# Altium schematic sheet CPU_Power.SchDoc: Title
size A1; Date: Date; CompanyName: Integrated Micro-Electronics Bulgaria; Organization: Design & Development Department; Address1: Drawing Type; Address2: Address 1; Address3: Address 2; Address4: Address 3; DocumentNumber: 730xxx; Revision: 01; SheetNumber: 1; SheetTotal: 1; PageSetup: Record=PageOptions|CenterHorizontal=True|CenterVertical=True|PrintScale=0.70|XCorrection=1.00|YCorrection=1.00|PrintKind=2|BorderSize=5000000|LeftOffset=0|BottomOffset=0|Orientation=2|PaperLength=1000|PaperWidth=1000|Scale=100|PaperSource=7|PrintQuality=-4|MediaType=1|DitherType=10|PaperKind=A4|PrintScaleMode=1; SheetSize: A3; Time: Time; ModifiedDate: Mod. Date
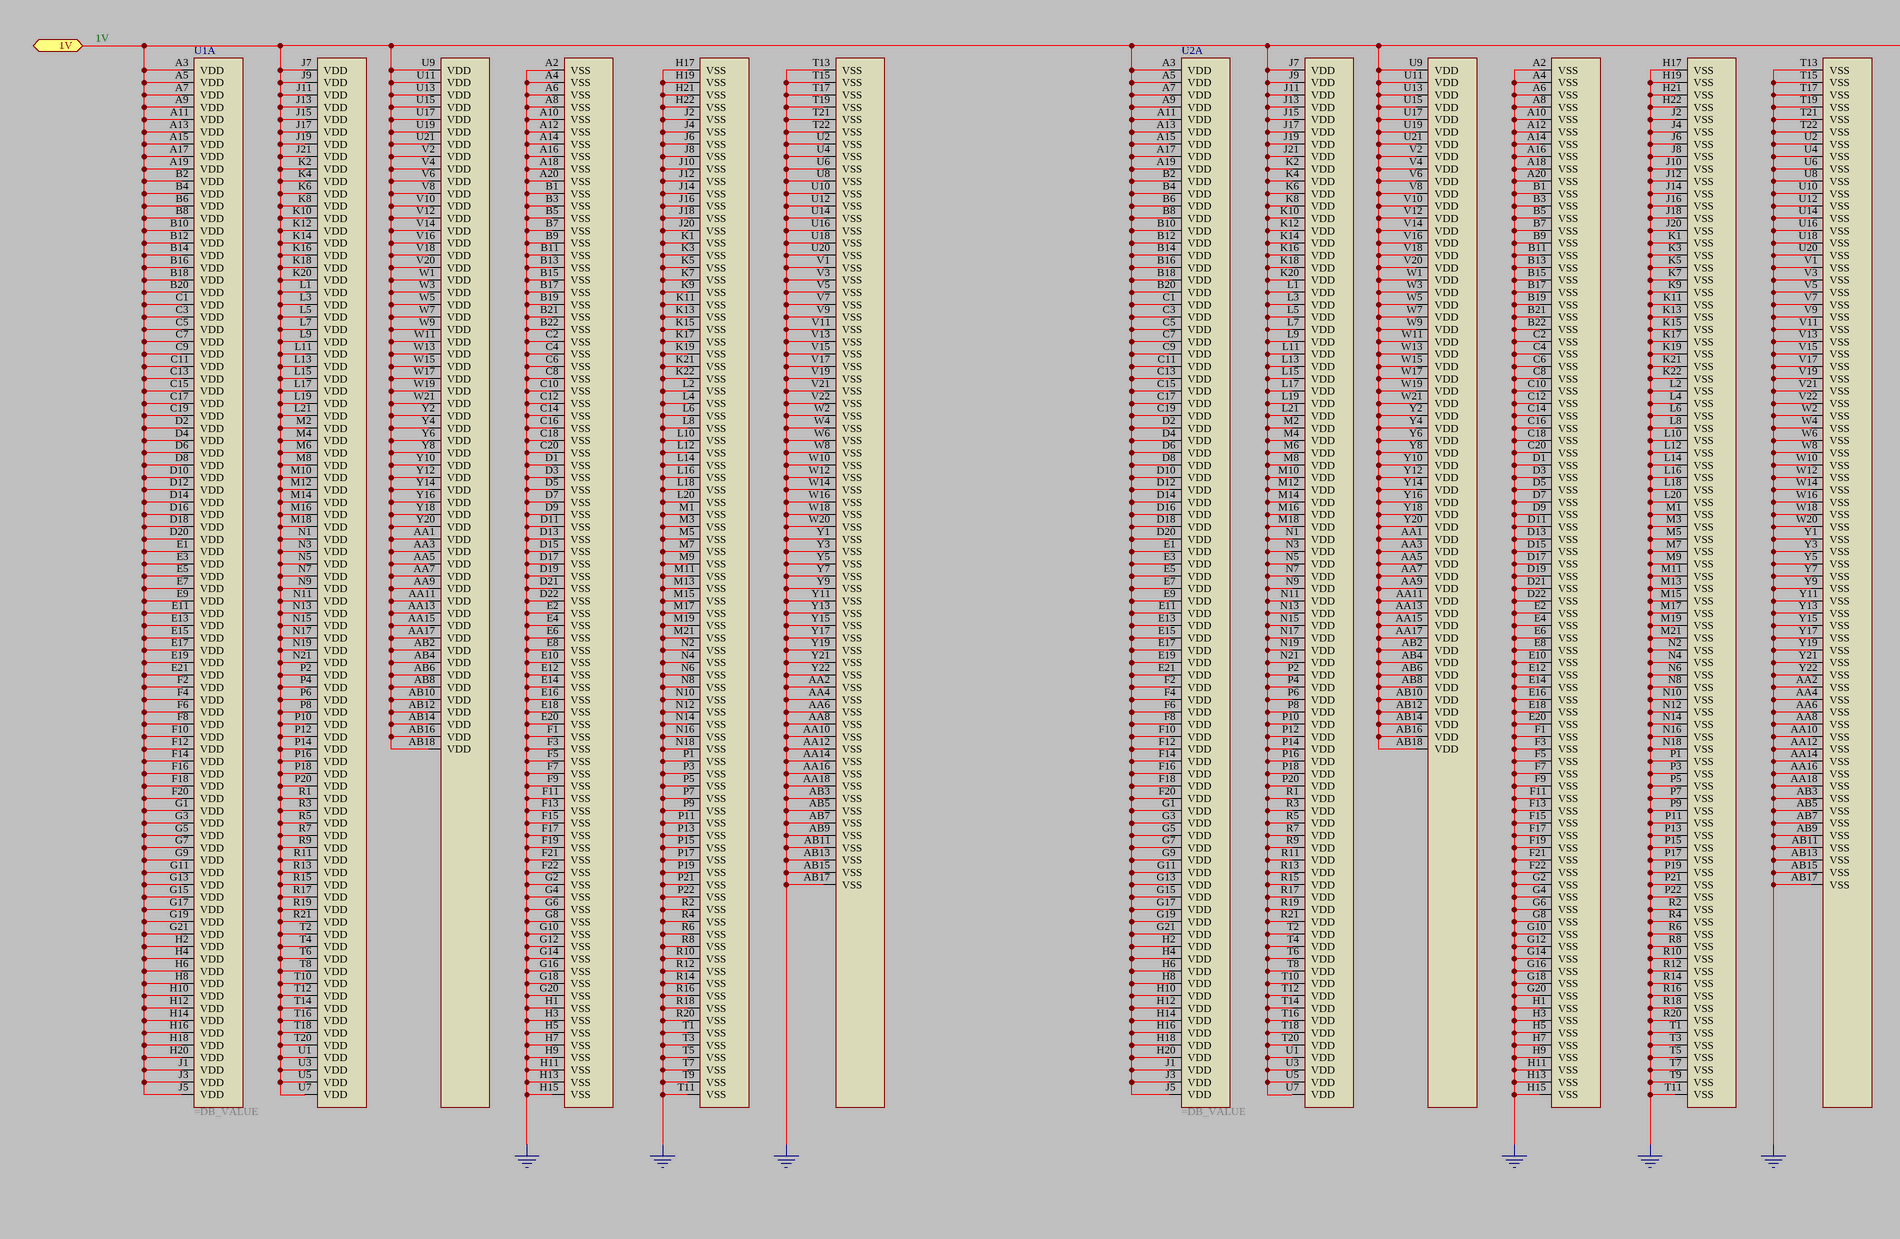
[diagram p0: CPU_Power.SchDoc, top left]
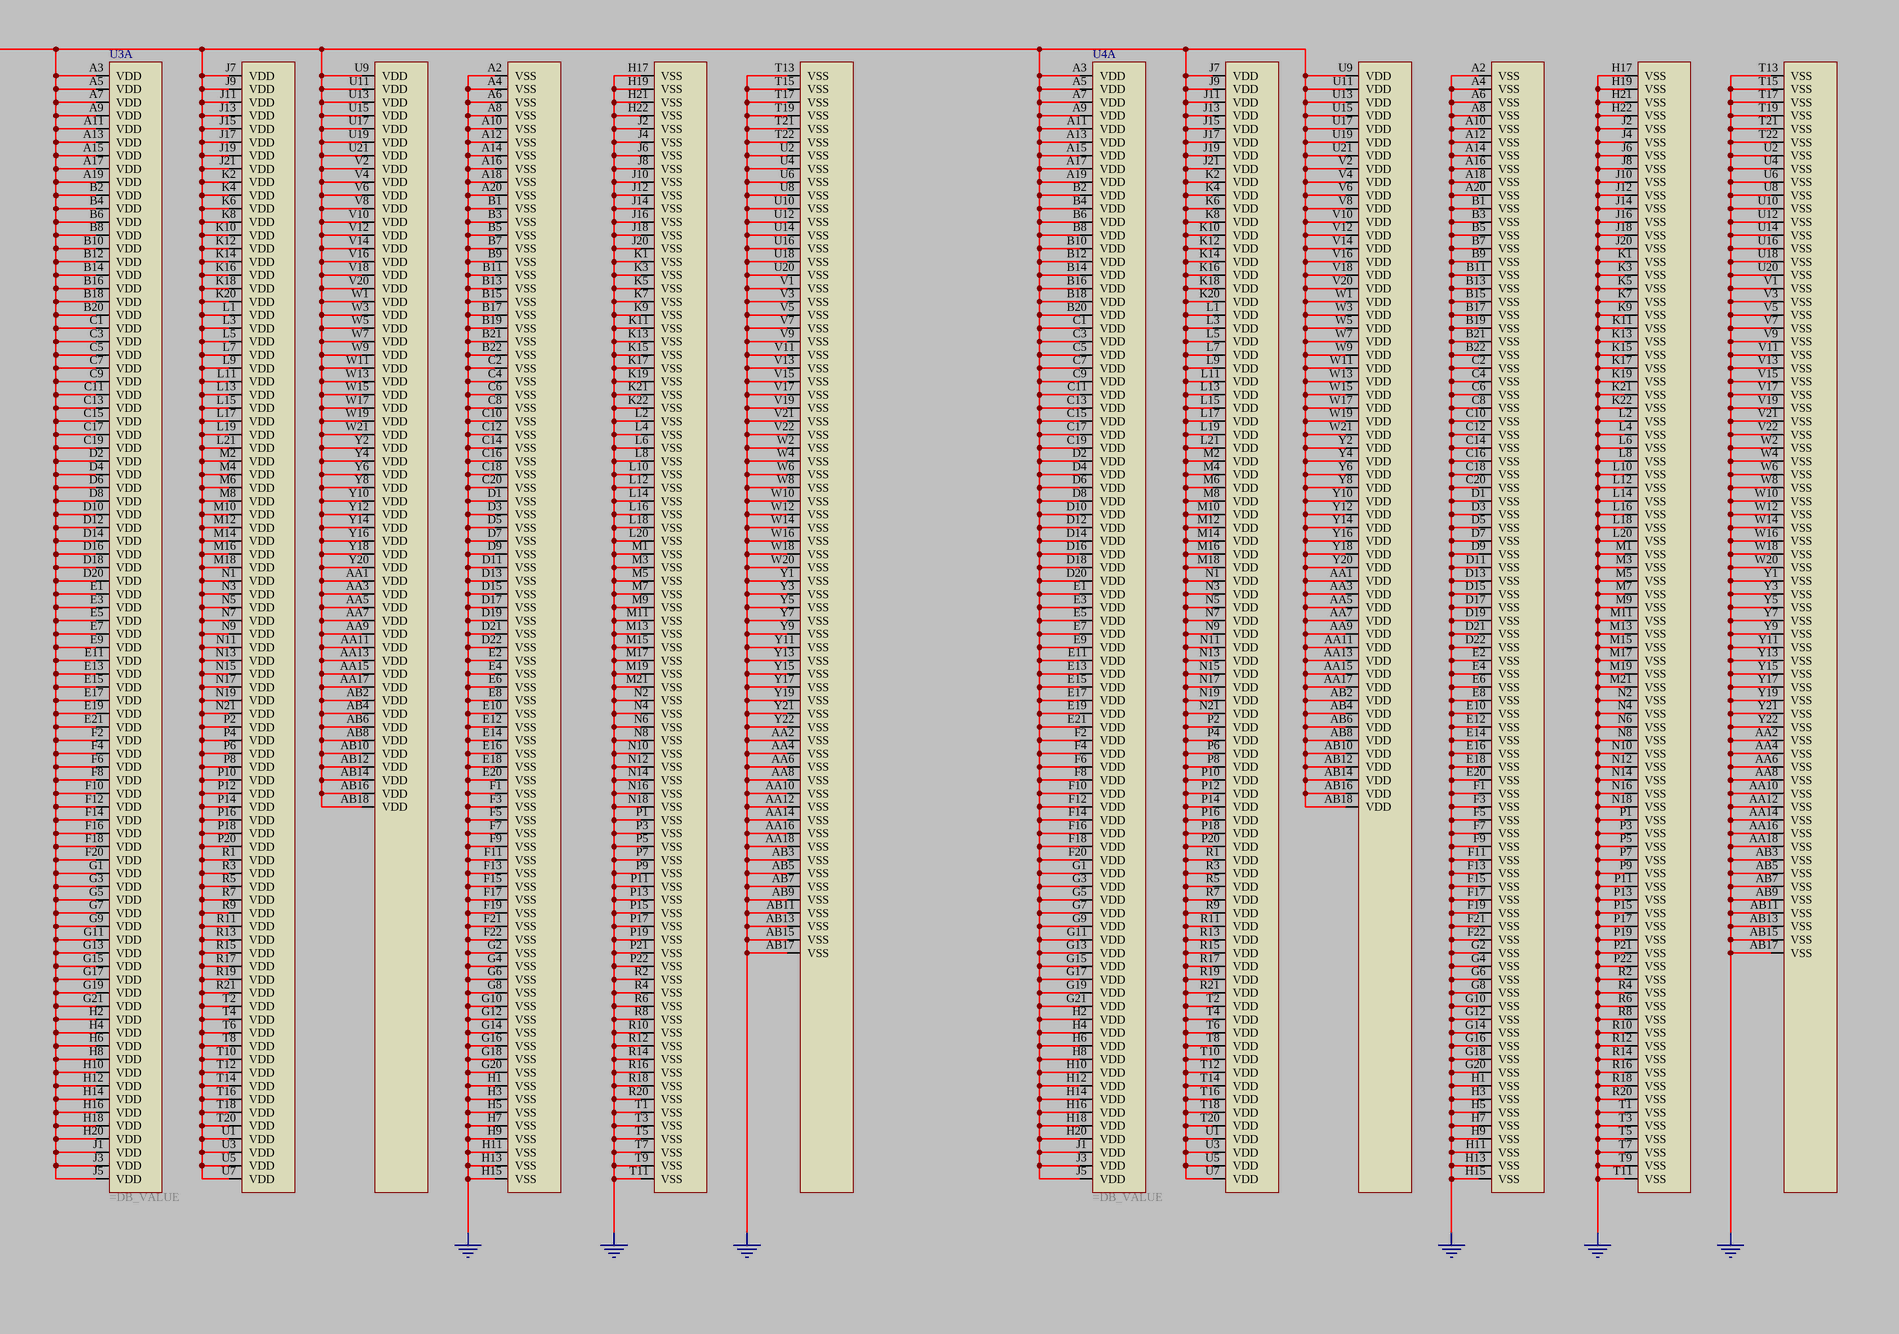
[diagram p1: CPU_Power.SchDoc, top right]
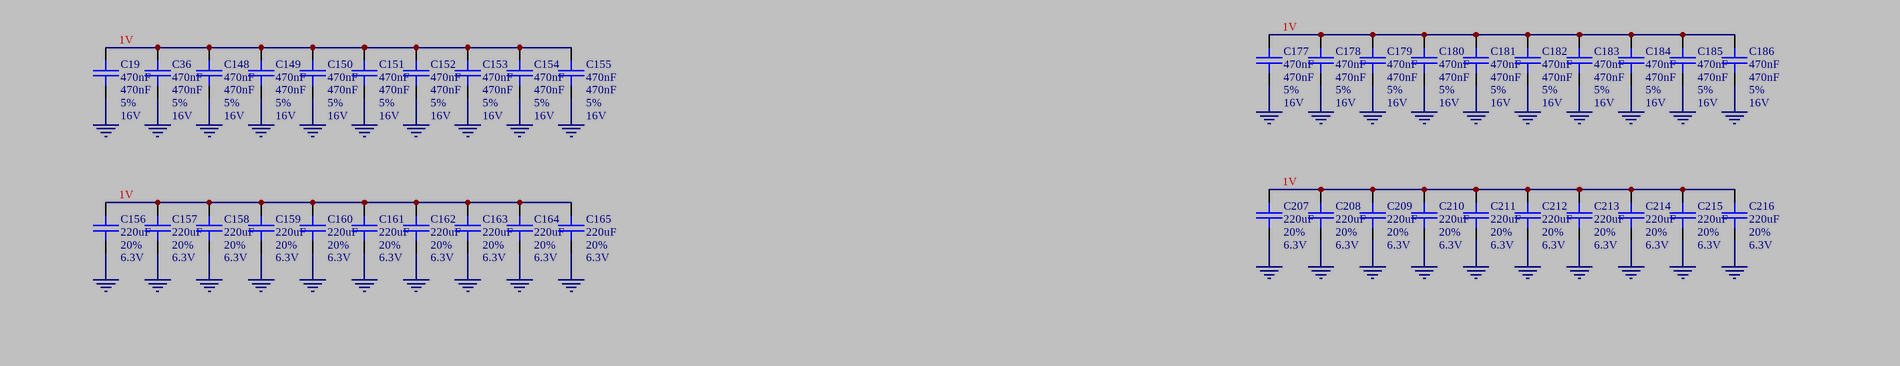
[diagram p2: CPU_Power.SchDoc, bottom left]
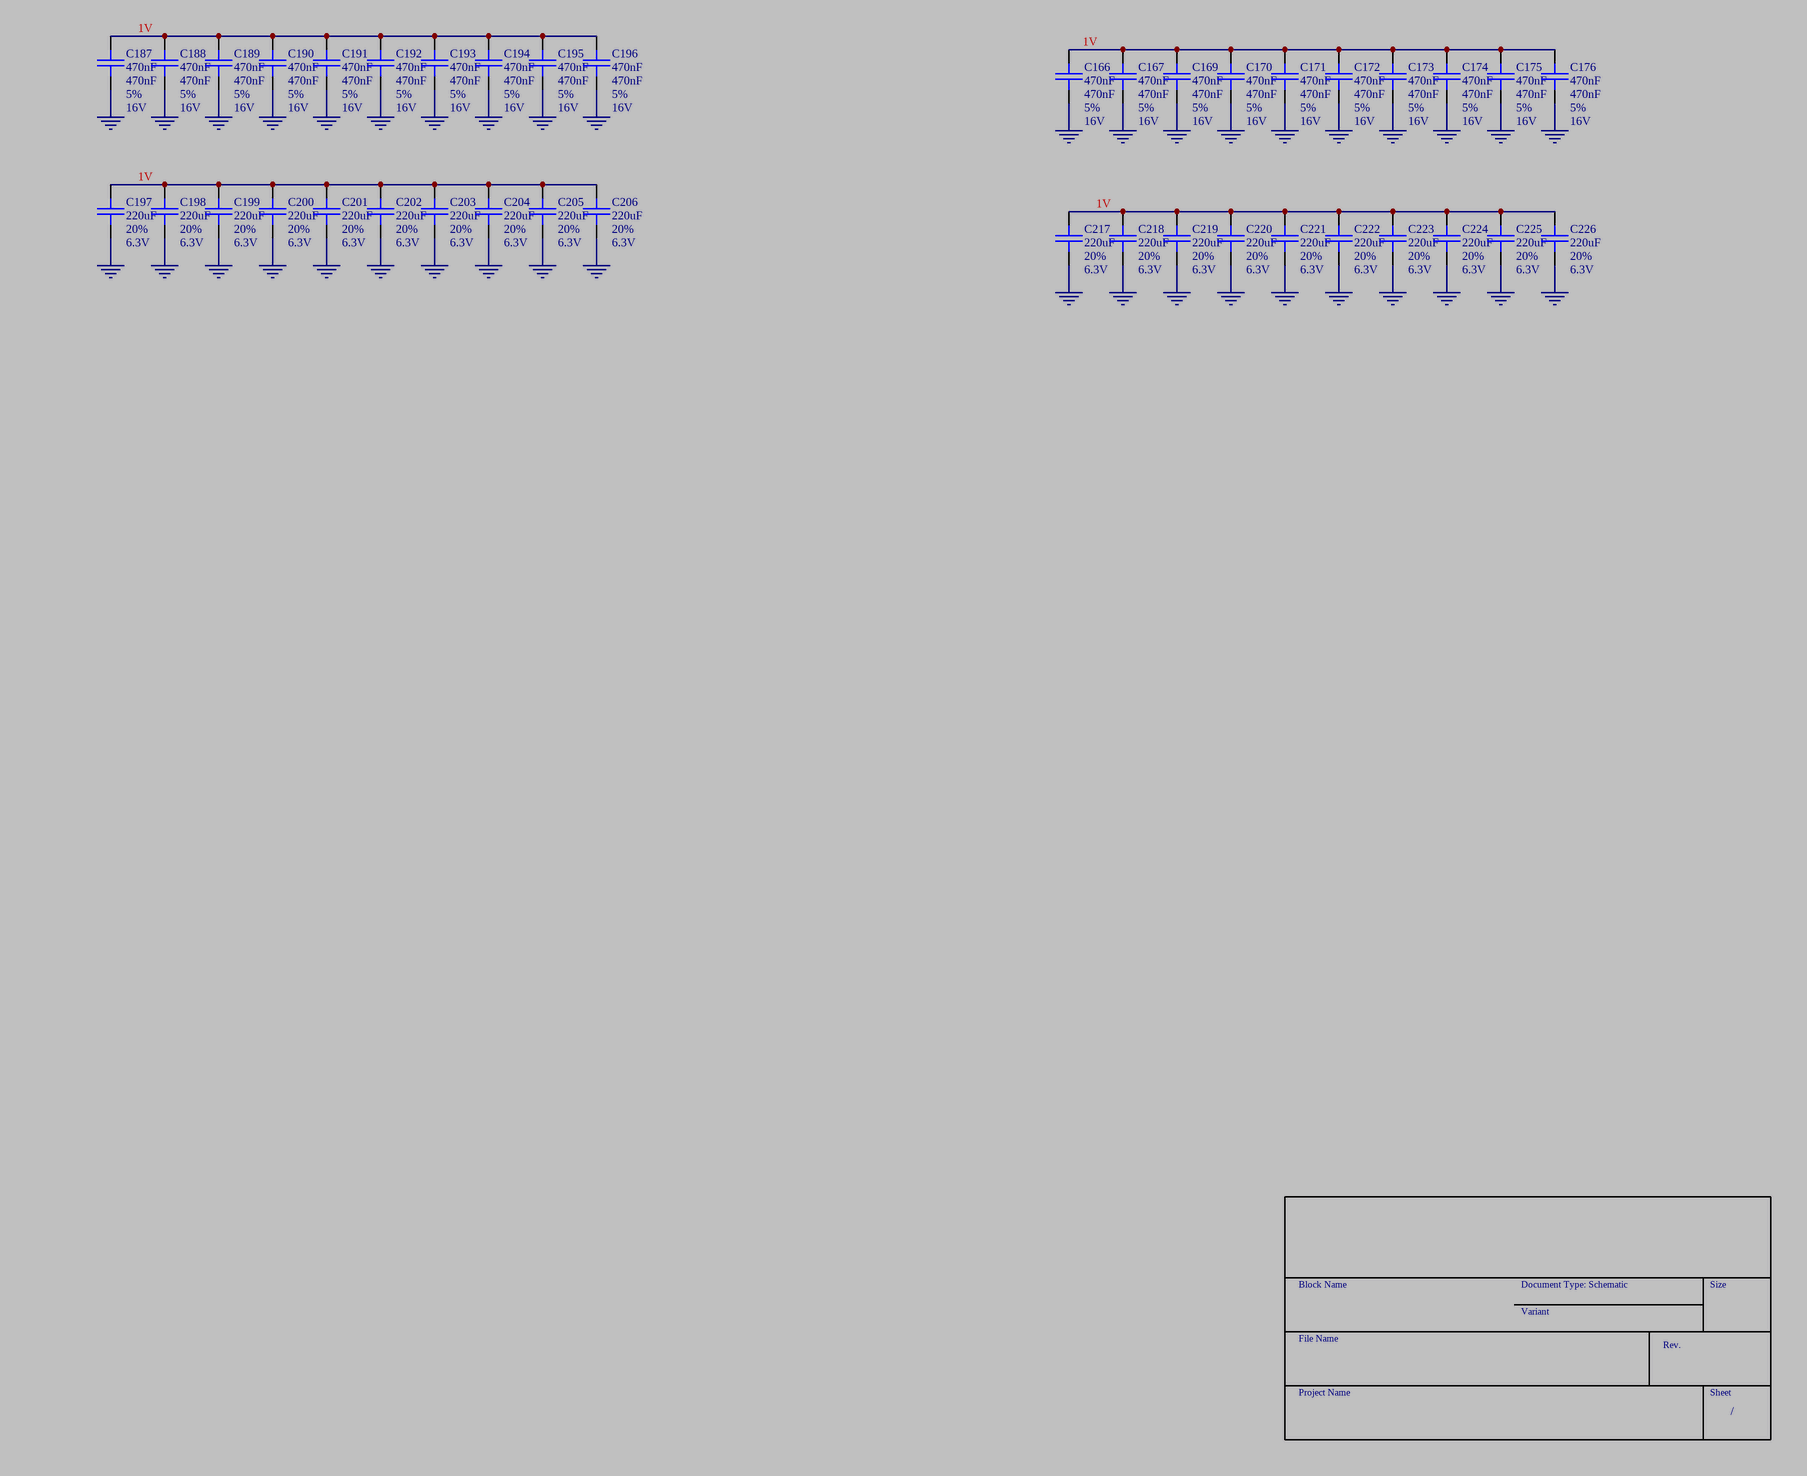
[diagram p3: CPU_Power.SchDoc, bottom right]

## Parts
C19  470nF  DB_TOLERANCE: 5%  DB_VOLTAGE: 16V  [SMD_0603_CAPC1608X95N]
C36  470nF  DB_TOLERANCE: 5%  DB_VOLTAGE: 16V  [SMD_0603_CAPC1608X95N]
C148  470nF  DB_TOLERANCE: 5%  DB_VOLTAGE: 16V  [SMD_0603_CAPC1608X95N]
C149  470nF  DB_TOLERANCE: 5%  DB_VOLTAGE: 16V  [SMD_0603_CAPC1608X95N]
C150  470nF  DB_TOLERANCE: 5%  DB_VOLTAGE: 16V  [SMD_0603_CAPC1608X95N]
C151  470nF  DB_TOLERANCE: 5%  DB_VOLTAGE: 16V  [SMD_0603_CAPC1608X95N]
C152  470nF  DB_TOLERANCE: 5%  DB_VOLTAGE: 16V  [SMD_0603_CAPC1608X95N]
C153  470nF  DB_TOLERANCE: 5%  DB_VOLTAGE: 16V  [SMD_0603_CAPC1608X95N]
C154  470nF  DB_TOLERANCE: 5%  DB_VOLTAGE: 16V  [SMD_0603_CAPC1608X95N]
C155  470nF  DB_TOLERANCE: 5%  DB_VOLTAGE: 16V  [SMD_0603_CAPC1608X95N]
C156  DB_TOLERANCE: 20%  DB_VOLTAGE: 6.3V  [SMD_1210_CAPC3225X279N]  (hidden comment: 220uF)
C157  DB_TOLERANCE: 20%  DB_VOLTAGE: 6.3V  [SMD_1210_CAPC3225X279N]  (hidden comment: 220uF)
C158  DB_TOLERANCE: 20%  DB_VOLTAGE: 6.3V  [SMD_1210_CAPC3225X279N]  (hidden comment: 220uF)
C159  DB_TOLERANCE: 20%  DB_VOLTAGE: 6.3V  [SMD_1210_CAPC3225X279N]  (hidden comment: 220uF)
C160  DB_TOLERANCE: 20%  DB_VOLTAGE: 6.3V  [SMD_1210_CAPC3225X279N]  (hidden comment: 220uF)
C161  DB_TOLERANCE: 20%  DB_VOLTAGE: 6.3V  [SMD_1210_CAPC3225X279N]  (hidden comment: 220uF)
C162  DB_TOLERANCE: 20%  DB_VOLTAGE: 6.3V  [SMD_1210_CAPC3225X279N]  (hidden comment: 220uF)
C163  DB_TOLERANCE: 20%  DB_VOLTAGE: 6.3V  [SMD_1210_CAPC3225X279N]  (hidden comment: 220uF)
C164  DB_TOLERANCE: 20%  DB_VOLTAGE: 6.3V  [SMD_1210_CAPC3225X279N]  (hidden comment: 220uF)
C165  DB_TOLERANCE: 20%  DB_VOLTAGE: 6.3V  [SMD_1210_CAPC3225X279N]  (hidden comment: 220uF)
C166  470nF  DB_TOLERANCE: 5%  DB_VOLTAGE: 16V  [SMD_0603_CAPC1608X95N]
C167  470nF  DB_TOLERANCE: 5%  DB_VOLTAGE: 16V  [SMD_0603_CAPC1608X95N]
C169  470nF  DB_TOLERANCE: 5%  DB_VOLTAGE: 16V  [SMD_0603_CAPC1608X95N]
C170  470nF  DB_TOLERANCE: 5%  DB_VOLTAGE: 16V  [SMD_0603_CAPC1608X95N]
C171  470nF  DB_TOLERANCE: 5%  DB_VOLTAGE: 16V  [SMD_0603_CAPC1608X95N]
C172  470nF  DB_TOLERANCE: 5%  DB_VOLTAGE: 16V  [SMD_0603_CAPC1608X95N]
C173  470nF  DB_TOLERANCE: 5%  DB_VOLTAGE: 16V  [SMD_0603_CAPC1608X95N]
C174  470nF  DB_TOLERANCE: 5%  DB_VOLTAGE: 16V  [SMD_0603_CAPC1608X95N]
C175  470nF  DB_TOLERANCE: 5%  DB_VOLTAGE: 16V  [SMD_0603_CAPC1608X95N]
C176  470nF  DB_TOLERANCE: 5%  DB_VOLTAGE: 16V  [SMD_0603_CAPC1608X95N]
C177  470nF  DB_TOLERANCE: 5%  DB_VOLTAGE: 16V  [SMD_0603_CAPC1608X95N]
C178  470nF  DB_TOLERANCE: 5%  DB_VOLTAGE: 16V  [SMD_0603_CAPC1608X95N]
C179  470nF  DB_TOLERANCE: 5%  DB_VOLTAGE: 16V  [SMD_0603_CAPC1608X95N]
C180  470nF  DB_TOLERANCE: 5%  DB_VOLTAGE: 16V  [SMD_0603_CAPC1608X95N]
C181  470nF  DB_TOLERANCE: 5%  DB_VOLTAGE: 16V  [SMD_0603_CAPC1608X95N]
C182  470nF  DB_TOLERANCE: 5%  DB_VOLTAGE: 16V  [SMD_0603_CAPC1608X95N]
C183  470nF  DB_TOLERANCE: 5%  DB_VOLTAGE: 16V  [SMD_0603_CAPC1608X95N]
C184  470nF  DB_TOLERANCE: 5%  DB_VOLTAGE: 16V  [SMD_0603_CAPC1608X95N]
C185  470nF  DB_TOLERANCE: 5%  DB_VOLTAGE: 16V  [SMD_0603_CAPC1608X95N]
C186  470nF  DB_TOLERANCE: 5%  DB_VOLTAGE: 16V  [SMD_0603_CAPC1608X95N]
C187  470nF  DB_TOLERANCE: 5%  DB_VOLTAGE: 16V  [SMD_0603_CAPC1608X95N]
C188  470nF  DB_TOLERANCE: 5%  DB_VOLTAGE: 16V  [SMD_0603_CAPC1608X95N]
C189  470nF  DB_TOLERANCE: 5%  DB_VOLTAGE: 16V  [SMD_0603_CAPC1608X95N]
C190  470nF  DB_TOLERANCE: 5%  DB_VOLTAGE: 16V  [SMD_0603_CAPC1608X95N]
C191  470nF  DB_TOLERANCE: 5%  DB_VOLTAGE: 16V  [SMD_0603_CAPC1608X95N]
C192  470nF  DB_TOLERANCE: 5%  DB_VOLTAGE: 16V  [SMD_0603_CAPC1608X95N]
C193  470nF  DB_TOLERANCE: 5%  DB_VOLTAGE: 16V  [SMD_0603_CAPC1608X95N]
C194  470nF  DB_TOLERANCE: 5%  DB_VOLTAGE: 16V  [SMD_0603_CAPC1608X95N]
C195  470nF  DB_TOLERANCE: 5%  DB_VOLTAGE: 16V  [SMD_0603_CAPC1608X95N]
C196  470nF  DB_TOLERANCE: 5%  DB_VOLTAGE: 16V  [SMD_0603_CAPC1608X95N]
C197  DB_TOLERANCE: 20%  DB_VOLTAGE: 6.3V  [SMD_1210_CAPC3225X279N]  (hidden comment: 220uF)
C198  DB_TOLERANCE: 20%  DB_VOLTAGE: 6.3V  [SMD_1210_CAPC3225X279N]  (hidden comment: 220uF)
C199  DB_TOLERANCE: 20%  DB_VOLTAGE: 6.3V  [SMD_1210_CAPC3225X279N]  (hidden comment: 220uF)
C200  DB_TOLERANCE: 20%  DB_VOLTAGE: 6.3V  [SMD_1210_CAPC3225X279N]  (hidden comment: 220uF)
C201  DB_TOLERANCE: 20%  DB_VOLTAGE: 6.3V  [SMD_1210_CAPC3225X279N]  (hidden comment: 220uF)
C202  DB_TOLERANCE: 20%  DB_VOLTAGE: 6.3V  [SMD_1210_CAPC3225X279N]  (hidden comment: 220uF)
C203  DB_TOLERANCE: 20%  DB_VOLTAGE: 6.3V  [SMD_1210_CAPC3225X279N]  (hidden comment: 220uF)
C204  DB_TOLERANCE: 20%  DB_VOLTAGE: 6.3V  [SMD_1210_CAPC3225X279N]  (hidden comment: 220uF)
C205  DB_TOLERANCE: 20%  DB_VOLTAGE: 6.3V  [SMD_1210_CAPC3225X279N]  (hidden comment: 220uF)
C206  DB_TOLERANCE: 20%  DB_VOLTAGE: 6.3V  [SMD_1210_CAPC3225X279N]  (hidden comment: 220uF)
C207  DB_TOLERANCE: 20%  DB_VOLTAGE: 6.3V  [SMD_1210_CAPC3225X279N]  (hidden comment: 220uF)
C208  DB_TOLERANCE: 20%  DB_VOLTAGE: 6.3V  [SMD_1210_CAPC3225X279N]  (hidden comment: 220uF)
C209  DB_TOLERANCE: 20%  DB_VOLTAGE: 6.3V  [SMD_1210_CAPC3225X279N]  (hidden comment: 220uF)
C210  DB_TOLERANCE: 20%  DB_VOLTAGE: 6.3V  [SMD_1210_CAPC3225X279N]  (hidden comment: 220uF)
C211  DB_TOLERANCE: 20%  DB_VOLTAGE: 6.3V  [SMD_1210_CAPC3225X279N]  (hidden comment: 220uF)
C212  DB_TOLERANCE: 20%  DB_VOLTAGE: 6.3V  [SMD_1210_CAPC3225X279N]  (hidden comment: 220uF)
C213  DB_TOLERANCE: 20%  DB_VOLTAGE: 6.3V  [SMD_1210_CAPC3225X279N]  (hidden comment: 220uF)
C214  DB_TOLERANCE: 20%  DB_VOLTAGE: 6.3V  [SMD_1210_CAPC3225X279N]  (hidden comment: 220uF)
C215  DB_TOLERANCE: 20%  DB_VOLTAGE: 6.3V  [SMD_1210_CAPC3225X279N]  (hidden comment: 220uF)
C216  DB_TOLERANCE: 20%  DB_VOLTAGE: 6.3V  [SMD_1210_CAPC3225X279N]  (hidden comment: 220uF)
C217  DB_TOLERANCE: 20%  DB_VOLTAGE: 6.3V  [SMD_1210_CAPC3225X279N]  (hidden comment: 220uF)
C218  DB_TOLERANCE: 20%  DB_VOLTAGE: 6.3V  [SMD_1210_CAPC3225X279N]  (hidden comment: 220uF)
C219  DB_TOLERANCE: 20%  DB_VOLTAGE: 6.3V  [SMD_1210_CAPC3225X279N]  (hidden comment: 220uF)
C220  DB_TOLERANCE: 20%  DB_VOLTAGE: 6.3V  [SMD_1210_CAPC3225X279N]  (hidden comment: 220uF)
C221  DB_TOLERANCE: 20%  DB_VOLTAGE: 6.3V  [SMD_1210_CAPC3225X279N]  (hidden comment: 220uF)
C222  DB_TOLERANCE: 20%  DB_VOLTAGE: 6.3V  [SMD_1210_CAPC3225X279N]  (hidden comment: 220uF)
C223  DB_TOLERANCE: 20%  DB_VOLTAGE: 6.3V  [SMD_1210_CAPC3225X279N]  (hidden comment: 220uF)
C224  DB_TOLERANCE: 20%  DB_VOLTAGE: 6.3V  [SMD_1210_CAPC3225X279N]  (hidden comment: 220uF)
C225  DB_TOLERANCE: 20%  DB_VOLTAGE: 6.3V  [SMD_1210_CAPC3225X279N]  (hidden comment: 220uF)
C226  DB_TOLERANCE: 20%  DB_VOLTAGE: 6.3V  [SMD_1210_CAPC3225X279N]  (hidden comment: 220uF)
U1  (no value)  [SMD_BGA480C80P22X22]  (part A of 2)
U2  (no value)  [SMD_BGA480C80P22X22]  (part A of 2)
U3  (no value)  [SMD_BGA480C80P22X22]  (part A of 2)
U4  (no value)  [SMD_BGA480C80P22X22]  (part A of 2)

## Ports
1V

## Nets
GND: C19.1 C36.1 C148.1 C149.1 C150.1 C151.1 C152.1 C153.1 C154.1 C155.1 C156.1 C157.1 C158.1 C159.1 C160.1 C161.1 C162.1 C163.1 C164.1 C165.1 C166.1 C167.1 C169.1 C170.1 C171.1 C172.1 C173.1 C174.1 C175.1 C176.1 C177.1 C178.1 C179.1 C180.1 C181.1 C182.1 C183.1 C184.1 C185.1 C186.1 C187.1 C188.1 C189.1 C190.1 C191.1 C192.1 C193.1 C194.1 C195.1 C196.1 C197.1 C198.1 C199.1 C200.1 C201.1 C202.1 C203.1 C204.1 C205.1 C206.1 C207.1 C208.1 C209.1 C210.1 C211.1 C212.1 C213.1 C214.1 C215.1 C216.1 C217.1 C218.1 C219.1 C220.1 C221.1 C222.1 C223.1 C224.1 C225.1 C226.1 U1.A2(VSS) U1.A4(VSS) U1.A6(VSS) U1.A8(VSS) U1.A10(VSS) U1.A12(VSS) U1.A14(VSS) U1.A16(VSS) U1.A18(VSS) U1.A20(VSS) U1.AA2(VSS) U1.AA4(VSS) U1.AA6(VSS) U1.AA8(VSS) U1.AA10(VSS) U1.AA12(VSS) U1.AA14(VSS) U1.AA16(VSS) U1.AA18(VSS) U1.AB3(VSS) U1.AB5(VSS) U1.AB7(VSS) U1.AB9(VSS) U1.AB11(VSS) U1.AB13(VSS) U1.AB15(VSS) U1.AB17(VSS) U1.B1(VSS) U1.B3(VSS) U1.B5(VSS) U1.B7(VSS) U1.B9(VSS) U1.B11(VSS) U1.B13(VSS) U1.B15(VSS) U1.B17(VSS) U1.B19(VSS) U1.B21(VSS) U1.B22(VSS) U1.C2(VSS) U1.C4(VSS) U1.C6(VSS) U1.C8(VSS) U1.C10(VSS) U1.C12(VSS) U1.C14(VSS) U1.C16(VSS) U1.C18(VSS) U1.C20(VSS) U1.D1(VSS) U1.D3(VSS) U1.D5(VSS) U1.D7(VSS) U1.D9(VSS) U1.D11(VSS) U1.D13(VSS) U1.D15(VSS) U1.D17(VSS) U1.D19(VSS) U1.D21(VSS) U1.D22(VSS) U1.E2(VSS) U1.E4(VSS) U1.E6(VSS) U1.E8(VSS) U1.E10(VSS) U1.E12(VSS) U1.E14(VSS) U1.E16(VSS) U1.E18(VSS) U1.E20(VSS) U1.F1(VSS) U1.F3(VSS) U1.F5(VSS) U1.F7(VSS) U1.F9(VSS) U1.F11(VSS) U1.F13(VSS) U1.F15(VSS) U1.F17(VSS) U1.F19(VSS) U1.F21(VSS) U1.F22(VSS) U1.G2(VSS) U1.G4(VSS) U1.G6(VSS) U1.G8(VSS) U1.G10(VSS) U1.G12(VSS) U1.G14(VSS) U1.G16(VSS) U1.G18(VSS) U1.G20(VSS) U1.H1(VSS) U1.H3(VSS) U1.H5(VSS) U1.H7(VSS) U1.H9(VSS) U1.H11(VSS) U1.H13(VSS) U1.H15(VSS) U1.H17(VSS) U1.H19(VSS) U1.H21(VSS) U1.H22(VSS) U1.J2(VSS) U1.J4(VSS) U1.J6(VSS) U1.J8(VSS) U1.J10(VSS) U1.J12(VSS) U1.J14(VSS) U1.J16(VSS) U1.J18(VSS) U1.J20(VSS) U1.K1(VSS) U1.K3(VSS) U1.K5(VSS) U1.K7(VSS) U1.K9(VSS) U1.K11(VSS) U1.K13(VSS) U1.K15(VSS) U1.K17(VSS) U1.K19(VSS) U1.K21(VSS) U1.K22(VSS) U1.L2(VSS) U1.L4(VSS) U1.L6(VSS) U1.L8(VSS) U1.L10(VSS) U1.L12(VSS) U1.L14(VSS) U1.L16(VSS) U1.L18(VSS) U1.L20(VSS) U1.M1(VSS) U1.M3(VSS) U1.M5(VSS) U1.M7(VSS) U1.M9(VSS) U1.M11(VSS) U1.M13(VSS) U1.M15(VSS) U1.M17(VSS) U1.M19(VSS) U1.M21(VSS) U1.N2(VSS) U1.N4(VSS) U1.N6(VSS) U1.N8(VSS) U1.N10(VSS) U1.N12(VSS) U1.N14(VSS) U1.N16(VSS) U1.N18(VSS) U1.P1(VSS) U1.P3(VSS) U1.P5(VSS) U1.P7(VSS) U1.P9(VSS) U1.P11(VSS) U1.P13(VSS) U1.P15(VSS) U1.P17(VSS) U1.P19(VSS) U1.P21(VSS) U1.P22(VSS) U1.R2(VSS) U1.R4(VSS) U1.R6(VSS) U1.R8(VSS) U1.R10(VSS) U1.R12(VSS) U1.R14(VSS) U1.R16(VSS) U1.R18(VSS) U1.R20(VSS) U1.T1(VSS) U1.T3(VSS) U1.T5(VSS) U1.T7(VSS) U1.T9(VSS) U1.T11(VSS) U1.T13(VSS) U1.T15(VSS) U1.T17(VSS) U1.T19(VSS) U1.T21(VSS) U1.T22(VSS) U1.U2(VSS) U1.U4(VSS) U1.U6(VSS) U1.U8(VSS) U1.U10(VSS) U1.U12(VSS) U1.U14(VSS) U1.U16(VSS) U1.U18(VSS) U1.U20(VSS) U1.V1(VSS) U1.V3(VSS) U1.V5(VSS) U1.V7(VSS) U1.V9(VSS) U1.V11(VSS) U1.V13(VSS) U1.V15(VSS) U1.V17(VSS) U1.V19(VSS) U1.V21(VSS) U1.V22(VSS) U1.W2(VSS) U1.W4(VSS) U1.W6(VSS) U1.W8(VSS) U1.W10(VSS) U1.W12(VSS) U1.W14(VSS) U1.W16(VSS) U1.W18(VSS) U1.W20(VSS) U1.Y1(VSS) U1.Y3(VSS) U1.Y5(VSS) U1.Y7(VSS) U1.Y9(VSS) U1.Y11(VSS) U1.Y13(VSS) U1.Y15(VSS) U1.Y17(VSS) U1.Y19(VSS) U1.Y21(VSS) U1.Y22(VSS) U2.A2(VSS) U2.A4(VSS) U2.A6(VSS) U2.A8(VSS) U2.A10(VSS) U2.A12(VSS) U2.A14(VSS) U2.A16(VSS) U2.A18(VSS) U2.A20(VSS) U2.AA2(VSS) U2.AA4(VSS) U2.AA6(VSS) U2.AA8(VSS) U2.AA10(VSS) U2.AA12(VSS) U2.AA14(VSS) U2.AA16(VSS) U2.AA18(VSS) U2.AB3(VSS) U2.AB5(VSS) U2.AB7(VSS) U2.AB9(VSS) U2.AB11(VSS) U2.AB13(VSS) U2.AB15(VSS) U2.AB17(VSS) U2.B1(VSS) U2.B3(VSS) U2.B5(VSS) U2.B7(VSS) U2.B9(VSS) U2.B11(VSS) U2.B13(VSS) U2.B15(VSS) U2.B17(VSS) U2.B19(VSS) U2.B21(VSS) U2.B22(VSS) U2.C2(VSS) U2.C4(VSS) U2.C6(VSS) U2.C8(VSS) U2.C10(VSS) U2.C12(VSS) U2.C14(VSS) U2.C16(VSS) U2.C18(VSS) U2.C20(VSS) U2.D1(VSS) U2.D3(VSS) U2.D5(VSS) U2.D7(VSS) U2.D9(VSS) U2.D11(VSS) U2.D13(VSS) U2.D15(VSS) U2.D17(VSS) U2.D19(VSS) U2.D21(VSS) U2.D22(VSS) U2.E2(VSS) U2.E4(VSS) U2.E6(VSS) U2.E8(VSS) U2.E10(VSS) U2.E12(VSS) U2.E14(VSS) U2.E16(VSS) U2.E18(VSS) U2.E20(VSS) U2.F1(VSS) U2.F3(VSS) U2.F5(VSS) U2.F7(VSS) U2.F9(VSS) U2.F11(VSS) U2.F13(VSS) U2.F15(VSS) U2.F17(VSS) U2.F19(VSS) U2.F21(VSS) U2.F22(VSS) U2.G2(VSS) U2.G4(VSS) U2.G6(VSS) U2.G8(VSS) U2.G10(VSS) U2.G12(VSS) U2.G14(VSS) U2.G16(VSS) U2.G18(VSS) U2.G20(VSS) U2.H1(VSS) U2.H3(VSS) U2.H5(VSS) U2.H7(VSS) U2.H9(VSS) U2.H11(VSS) U2.H13(VSS) U2.H15(VSS) U2.H17(VSS) U2.H19(VSS) U2.H21(VSS) U2.H22(VSS) U2.J2(VSS) U2.J4(VSS) U2.J6(VSS) U2.J8(VSS) U2.J10(VSS) U2.J12(VSS) U2.J14(VSS) U2.J16(VSS) U2.J18(VSS) U2.J20(VSS) U2.K1(VSS) U2.K3(VSS) U2.K5(VSS) U2.K7(VSS) U2.K9(VSS) U2.K11(VSS) U2.K13(VSS) U2.K15(VSS) U2.K17(VSS) U2.K19(VSS) U2.K21(VSS) U2.K22(VSS) U2.L2(VSS) U2.L4(VSS) U2.L6(VSS) U2.L8(VSS) U2.L10(VSS) U2.L12(VSS) U2.L14(VSS) U2.L16(VSS) U2.L18(VSS) U2.L20(VSS) U2.M1(VSS) U2.M3(VSS) U2.M5(VSS) U2.M7(VSS) U2.M9(VSS) U2.M11(VSS) U2.M13(VSS) U2.M15(VSS) U2.M17(VSS) U2.M19(VSS) U2.M21(VSS) U2.N2(VSS) U2.N4(VSS) U2.N6(VSS) U2.N8(VSS) U2.N10(VSS) U2.N12(VSS) U2.N14(VSS) U2.N16(VSS) U2.N18(VSS) U2.P1(VSS) U2.P3(VSS) U2.P5(VSS) U2.P7(VSS) U2.P9(VSS) U2.P11(VSS) U2.P13(VSS) U2.P15(VSS) U2.P17(VSS) U2.P19(VSS) U2.P21(VSS) U2.P22(VSS) U2.R2(VSS) U2.R4(VSS) U2.R6(VSS) U2.R8(VSS) U2.R10(VSS) U2.R12(VSS) U2.R14(VSS) U2.R16(VSS) U2.R18(VSS) U2.R20(VSS) U2.T1(VSS) U2.T3(VSS) U2.T5(VSS) U2.T7(VSS) U2.T9(VSS) U2.T11(VSS) U2.T13(VSS) U2.T15(VSS) U2.T17(VSS) U2.T19(VSS) U2.T21(VSS) U2.T22(VSS) U2.U2(VSS) U2.U4(VSS) U2.U6(VSS) U2.U8(VSS) U2.U10(VSS) U2.U12(VSS) U2.U14(VSS) U2.U16(VSS) U2.U18(VSS) U2.U20(VSS) U2.V1(VSS) U2.V3(VSS) U2.V5(VSS) U2.V7(VSS) U2.V9(VSS) U2.V11(VSS) U2.V13(VSS) U2.V15(VSS) U2.V17(VSS) U2.V19(VSS) U2.V21(VSS) U2.V22(VSS) U2.W2(VSS) U2.W4(VSS) U2.W6(VSS) U2.W8(VSS) U2.W10(VSS) U2.W12(VSS) U2.W14(VSS) U2.W16(VSS) U2.W18(VSS) U2.W20(VSS) U2.Y1(VSS) U2.Y3(VSS) U2.Y5(VSS) U2.Y7(VSS) U2.Y9(VSS) U2.Y11(VSS) U2.Y13(VSS) U2.Y15(VSS) U2.Y17(VSS) U2.Y19(VSS) U2.Y21(VSS) U2.Y22(VSS) U3.A2(VSS) U3.A4(VSS) U3.A6(VSS) U3.A8(VSS) U3.A10(VSS) U3.A12(VSS) U3.A14(VSS) U3.A16(VSS) U3.A18(VSS) U3.A20(VSS) U3.AA2(VSS) U3.AA4(VSS) U3.AA6(VSS) U3.AA8(VSS) U3.AA10(VSS) U3.AA12(VSS) U3.AA14(VSS) U3.AA16(VSS) U3.AA18(VSS) U3.AB3(VSS) U3.AB5(VSS) U3.AB7(VSS) U3.AB9(VSS) U3.AB11(VSS) U3.AB13(VSS) U3.AB15(VSS) U3.AB17(VSS) U3.B1(VSS) U3.B3(VSS) U3.B5(VSS) U3.B7(VSS) U3.B9(VSS) U3.B11(VSS) U3.B13(VSS) U3.B15(VSS) U3.B17(VSS) U3.B19(VSS) U3.B21(VSS) U3.B22(VSS) U3.C2(VSS) U3.C4(VSS) U3.C6(VSS) U3.C8(VSS) U3.C10(VSS) U3.C12(VSS) U3.C14(VSS) U3.C16(VSS) U3.C18(VSS) U3.C20(VSS) U3.D1(VSS) U3.D3(VSS) U3.D5(VSS) U3.D7(VSS) U3.D9(VSS) U3.D11(VSS) U3.D13(VSS) U3.D15(VSS) U3.D17(VSS) U3.D19(VSS) U3.D21(VSS) U3.D22(VSS) U3.E2(VSS) U3.E4(VSS) U3.E6(VSS) U3.E8(VSS) U3.E10(VSS) U3.E12(VSS) U3.E14(VSS) U3.E16(VSS) U3.E18(VSS) U3.E20(VSS) U3.F1(VSS) U3.F3(VSS) U3.F5(VSS) U3.F7(VSS) U3.F9(VSS) U3.F11(VSS) U3.F13(VSS) U3.F15(VSS) U3.F17(VSS) U3.F19(VSS) U3.F21(VSS) U3.F22(VSS) U3.G2(VSS) U3.G4(VSS) U3.G6(VSS) U3.G8(VSS) U3.G10(VSS) U3.G12(VSS) U3.G14(VSS) U3.G16(VSS) U3.G18(VSS) U3.G20(VSS) U3.H1(VSS) U3.H3(VSS) U3.H5(VSS) U3.H7(VSS) U3.H9(VSS) U3.H11(VSS) U3.H13(VSS) U3.H15(VSS) U3.H17(VSS) U3.H19(VSS) U3.H21(VSS) U3.H22(VSS) U3.J2(VSS) U3.J4(VSS) U3.J6(VSS) U3.J8(VSS) U3.J10(VSS) U3.J12(VSS) U3.J14(VSS) U3.J16(VSS) U3.J18(VSS) U3.J20(VSS) U3.K1(VSS) U3.K3(VSS) U3.K5(VSS) U3.K7(VSS) U3.K9(VSS) U3.K11(VSS) U3.K13(VSS) U3.K15(VSS) U3.K17(VSS) U3.K19(VSS) U3.K21(VSS) U3.K22(VSS) U3.L2(VSS) U3.L4(VSS) U3.L6(VSS) U3.L8(VSS) U3.L10(VSS) U3.L12(VSS) U3.L14(VSS) U3.L16(VSS) U3.L18(VSS) U3.L20(VSS) U3.M1(VSS) U3.M3(VSS) U3.M5(VSS) U3.M7(VSS) U3.M9(VSS) U3.M11(VSS) U3.M13(VSS) U3.M15(VSS) U3.M17(VSS) U3.M19(VSS) U3.M21(VSS) U3.N2(VSS) U3.N4(VSS) U3.N6(VSS) U3.N8(VSS) U3.N10(VSS) U3.N12(VSS) U3.N14(VSS) U3.N16(VSS) U3.N18(VSS) U3.P1(VSS) U3.P3(VSS) U3.P5(VSS) U3.P7(VSS) U3.P9(VSS) U3.P11(VSS) U3.P13(VSS) U3.P15(VSS) U3.P17(VSS) U3.P19(VSS) U3.P21(VSS) U3.P22(VSS) U3.R2(VSS) U3.R4(VSS) U3.R6(VSS) U3.R8(VSS) U3.R10(VSS) U3.R12(VSS) U3.R14(VSS) U3.R16(VSS) U3.R18(VSS) U3.R20(VSS) U3.T1(VSS) U3.T3(VSS) U3.T5(VSS) U3.T7(VSS) U3.T9(VSS) U3.T11(VSS) U3.T13(VSS) U3.T15(VSS) U3.T17(VSS) U3.T19(VSS) U3.T21(VSS) U3.T22(VSS) U3.U2(VSS) U3.U4(VSS) U3.U6(VSS) U3.U8(VSS) U3.U10(VSS) U3.U12(VSS) U3.U14(VSS) U3.U16(VSS) U3.U18(VSS) U3.U20(VSS) U3.V1(VSS) U3.V3(VSS) U3.V5(VSS) U3.V7(VSS) U3.V9(VSS) U3.V11(VSS) U3.V13(VSS) U3.V15(VSS) U3.V17(VSS) U3.V19(VSS) U3.V21(VSS) U3.V22(VSS) U3.W2(VSS) U3.W4(VSS) U3.W6(VSS) U3.W8(VSS) U3.W10(VSS) U3.W12(VSS) U3.W14(VSS) U3.W16(VSS) U3.W18(VSS) U3.W20(VSS) U3.Y1(VSS) U3.Y3(VSS) U3.Y5(VSS) U3.Y7(VSS) U3.Y9(VSS) U3.Y11(VSS) U3.Y13(VSS) U3.Y15(VSS) U3.Y17(VSS) U3.Y19(VSS) U3.Y21(VSS) U3.Y22(VSS) U4.A2(VSS) U4.A4(VSS) U4.A6(VSS) U4.A8(VSS) U4.A10(VSS) U4.A12(VSS) U4.A14(VSS) U4.A16(VSS) U4.A18(VSS) U4.A20(VSS) U4.AA2(VSS) U4.AA4(VSS) U4.AA6(VSS) U4.AA8(VSS) U4.AA10(VSS) U4.AA12(VSS) U4.AA14(VSS) U4.AA16(VSS) U4.AA18(VSS) U4.AB3(VSS) U4.AB5(VSS) U4.AB7(VSS) U4.AB9(VSS) U4.AB11(VSS) U4.AB13(VSS) U4.AB15(VSS) U4.AB17(VSS) U4.B1(VSS) U4.B3(VSS) U4.B5(VSS) U4.B7(VSS) U4.B9(VSS) U4.B11(VSS) U4.B13(VSS) U4.B15(VSS) U4.B17(VSS) U4.B19(VSS) U4.B21(VSS) U4.B22(VSS) U4.C2(VSS) U4.C4(VSS) U4.C6(VSS) U4.C8(VSS) U4.C10(VSS) U4.C12(VSS) U4.C14(VSS) U4.C16(VSS) U4.C18(VSS) U4.C20(VSS) U4.D1(VSS) U4.D3(VSS) U4.D5(VSS) U4.D7(VSS) U4.D9(VSS) U4.D11(VSS) U4.D13(VSS) U4.D15(VSS) U4.D17(VSS) U4.D19(VSS) U4.D21(VSS) U4.D22(VSS) U4.E2(VSS) U4.E4(VSS) U4.E6(VSS) U4.E8(VSS) U4.E10(VSS) U4.E12(VSS) U4.E14(VSS) U4.E16(VSS) U4.E18(VSS) U4.E20(VSS) U4.F1(VSS) U4.F3(VSS) U4.F5(VSS) U4.F7(VSS) U4.F9(VSS) U4.F11(VSS) U4.F13(VSS) U4.F15(VSS) U4.F17(VSS) U4.F19(VSS) U4.F21(VSS) U4.F22(VSS) U4.G2(VSS) U4.G4(VSS) U4.G6(VSS) U4.G8(VSS) U4.G10(VSS) U4.G12(VSS) U4.G14(VSS) U4.G16(VSS) U4.G18(VSS) U4.G20(VSS) U4.H1(VSS) U4.H3(VSS) U4.H5(VSS) U4.H7(VSS) U4.H9(VSS) U4.H11(VSS) U4.H13(VSS) U4.H15(VSS) U4.H17(VSS) U4.H19(VSS) U4.H21(VSS) U4.H22(VSS) U4.J2(VSS) U4.J4(VSS) U4.J6(VSS) U4.J8(VSS) U4.J10(VSS) U4.J12(VSS) U4.J14(VSS) U4.J16(VSS) U4.J18(VSS) U4.J20(VSS) U4.K1(VSS) U4.K3(VSS) U4.K5(VSS) U4.K7(VSS) U4.K9(VSS) U4.K11(VSS) U4.K13(VSS) U4.K15(VSS) U4.K17(VSS) U4.K19(VSS) U4.K21(VSS) U4.K22(VSS) U4.L2(VSS) U4.L4(VSS) U4.L6(VSS) U4.L8(VSS) U4.L10(VSS) U4.L12(VSS) U4.L14(VSS) U4.L16(VSS) U4.L18(VSS) U4.L20(VSS) U4.M1(VSS) U4.M3(VSS) U4.M5(VSS) U4.M7(VSS) U4.M9(VSS) U4.M11(VSS) U4.M13(VSS) U4.M15(VSS) U4.M17(VSS) U4.M19(VSS) U4.M21(VSS) U4.N2(VSS) U4.N4(VSS) U4.N6(VSS) U4.N8(VSS) U4.N10(VSS) U4.N12(VSS) U4.N14(VSS) U4.N16(VSS) U4.N18(VSS) U4.P1(VSS) U4.P3(VSS) U4.P5(VSS) U4.P7(VSS) U4.P9(VSS) U4.P11(VSS) U4.P13(VSS) U4.P15(VSS) U4.P17(VSS) U4.P19(VSS) U4.P21(VSS) U4.P22(VSS) U4.R2(VSS) U4.R4(VSS) U4.R6(VSS) U4.R8(VSS) U4.R10(VSS) U4.R12(VSS) U4.R14(VSS) U4.R16(VSS) U4.R18(VSS) U4.R20(VSS) U4.T1(VSS) U4.T3(VSS) U4.T5(VSS) U4.T7(VSS) U4.T9(VSS) U4.T11(VSS) U4.T13(VSS) U4.T15(VSS) U4.T17(VSS) U4.T19(VSS) U4.T21(VSS) U4.T22(VSS) U4.U2(VSS) U4.U4(VSS) U4.U6(VSS) U4.U8(VSS) U4.U10(VSS) U4.U12(VSS) U4.U14(VSS) U4.U16(VSS) U4.U18(VSS) U4.U20(VSS) U4.V1(VSS) U4.V3(VSS) U4.V5(VSS) U4.V7(VSS) U4.V9(VSS) U4.V11(VSS) U4.V13(VSS) U4.V15(VSS) U4.V17(VSS) U4.V19(VSS) U4.V21(VSS) U4.V22(VSS) U4.W2(VSS) U4.W4(VSS) U4.W6(VSS) U4.W8(VSS) U4.W10(VSS) U4.W12(VSS) U4.W14(VSS) U4.W16(VSS) U4.W18(VSS) U4.W20(VSS) U4.Y1(VSS) U4.Y3(VSS) U4.Y5(VSS) U4.Y7(VSS) U4.Y9(VSS) U4.Y11(VSS) U4.Y13(VSS) U4.Y15(VSS) U4.Y17(VSS) U4.Y19(VSS) U4.Y21(VSS) U4.Y22(VSS)
1V: C19.2 C36.2 C148.2 C149.2 C150.2 C151.2 C152.2 C153.2 C154.2 C155.2 C156.2 C157.2 C158.2 C159.2 C160.2 C161.2 C162.2 C163.2 C164.2 C165.2 C166.2 C167.2 C169.2 C170.2 C171.2 C172.2 C173.2 C174.2 C175.2 C176.2 C177.2 C178.2 C179.2 C180.2 C181.2 C182.2 C183.2 C184.2 C185.2 C186.2 C187.2 C188.2 C189.2 C190.2 C191.2 C192.2 C193.2 C194.2 C195.2 C196.2 C197.2 C198.2 C199.2 C200.2 C201.2 C202.2 C203.2 C204.2 C205.2 C206.2 C207.2 C208.2 C209.2 C210.2 C211.2 C212.2 C213.2 C214.2 C215.2 C216.2 C217.2 C218.2 C219.2 C220.2 C221.2 C222.2 C223.2 C224.2 C225.2 C226.2 U1.A3(VDD) U1.A5(VDD) U1.A7(VDD) U1.A9(VDD) U1.A11(VDD) U1.A13(VDD) U1.A15(VDD) U1.A17(VDD) U1.A19(VDD) U1.AA1(VDD) U1.AA3(VDD) U1.AA5(VDD) U1.AA7(VDD) U1.AA9(VDD) U1.AA11(VDD) U1.AA13(VDD) U1.AA15(VDD) U1.AA17(VDD) U1.AB2(VDD) U1.AB4(VDD) U1.AB6(VDD) U1.AB8(VDD) U1.AB10(VDD) U1.AB12(VDD) U1.AB14(VDD) U1.AB16(VDD) U1.AB18(VDD) U1.B2(VDD) U1.B4(VDD) U1.B6(VDD) U1.B8(VDD) U1.B10(VDD) U1.B12(VDD) U1.B14(VDD) U1.B16(VDD) U1.B18(VDD) U1.B20(VDD) U1.C1(VDD) U1.C3(VDD) U1.C5(VDD) U1.C7(VDD) U1.C9(VDD) U1.C11(VDD) U1.C13(VDD) U1.C15(VDD) U1.C17(VDD) U1.C19(VDD) U1.D2(VDD) U1.D4(VDD) U1.D6(VDD) U1.D8(VDD) U1.D10(VDD) U1.D12(VDD) U1.D14(VDD) U1.D16(VDD) U1.D18(VDD) U1.D20(VDD) U1.E1(VDD) U1.E3(VDD) U1.E5(VDD) U1.E7(VDD) U1.E9(VDD) U1.E11(VDD) U1.E13(VDD) U1.E15(VDD) U1.E17(VDD) U1.E19(VDD) U1.E21(VDD) U1.F2(VDD) U1.F4(VDD) U1.F6(VDD) U1.F8(VDD) U1.F10(VDD) U1.F12(VDD) U1.F14(VDD) U1.F16(VDD) U1.F18(VDD) U1.F20(VDD) U1.G1(VDD) U1.G3(VDD) U1.G5(VDD) U1.G7(VDD) U1.G9(VDD) U1.G11(VDD) U1.G13(VDD) U1.G15(VDD) U1.G17(VDD) U1.G19(VDD) U1.G21(VDD) U1.H2(VDD) U1.H4(VDD) U1.H6(VDD) U1.H8(VDD) U1.H10(VDD) U1.H12(VDD) U1.H14(VDD) U1.H16(VDD) U1.H18(VDD) U1.H20(VDD) U1.J1(VDD) U1.J3(VDD) U1.J5(VDD) U1.J7(VDD) U1.J9(VDD) U1.J11(VDD) U1.J13(VDD) U1.J15(VDD) U1.J17(VDD) U1.J19(VDD) U1.J21(VDD) U1.K2(VDD) U1.K4(VDD) U1.K6(VDD) U1.K8(VDD) U1.K10(VDD) U1.K12(VDD) U1.K14(VDD) U1.K16(VDD) U1.K18(VDD) U1.K20(VDD) U1.L1(VDD) U1.L3(VDD) U1.L5(VDD) U1.L7(VDD) U1.L9(VDD) U1.L11(VDD) U1.L13(VDD) U1.L15(VDD) U1.L17(VDD) U1.L19(VDD) U1.L21(VDD) U1.M2(VDD) U1.M4(VDD) U1.M6(VDD) U1.M8(VDD) U1.M10(VDD) U1.M12(VDD) U1.M14(VDD) U1.M16(VDD) U1.M18(VDD) U1.N1(VDD) U1.N3(VDD) U1.N5(VDD) U1.N7(VDD) U1.N9(VDD) U1.N11(VDD) U1.N13(VDD) U1.N15(VDD) U1.N17(VDD) U1.N19(VDD) U1.N21(VDD) U1.P2(VDD) U1.P4(VDD) U1.P6(VDD) U1.P8(VDD) U1.P10(VDD) U1.P12(VDD) U1.P14(VDD) U1.P16(VDD) U1.P18(VDD) U1.P20(VDD) U1.R1(VDD) U1.R3(VDD) U1.R5(VDD) U1.R7(VDD) U1.R9(VDD) U1.R11(VDD) U1.R13(VDD) U1.R15(VDD) U1.R17(VDD) U1.R19(VDD) U1.R21(VDD) U1.T2(VDD) U1.T4(VDD) U1.T6(VDD) U1.T8(VDD) U1.T10(VDD) U1.T12(VDD) U1.T14(VDD) U1.T16(VDD) U1.T18(VDD) U1.T20(VDD) U1.U1(VDD) U1.U3(VDD) U1.U5(VDD) U1.U7(VDD) U1.U9(VDD) U1.U11(VDD) U1.U13(VDD) U1.U15(VDD) U1.U17(VDD) U1.U19(VDD) U1.U21(VDD) U1.V2(VDD) U1.V4(VDD) U1.V6(VDD) U1.V8(VDD) U1.V10(VDD) U1.V12(VDD) U1.V14(VDD) U1.V16(VDD) U1.V18(VDD) U1.V20(VDD) U1.W1(VDD) U1.W3(VDD) U1.W5(VDD) U1.W7(VDD) U1.W9(VDD) U1.W11(VDD) U1.W13(VDD) U1.W15(VDD) U1.W17(VDD) U1.W19(VDD) U1.W21(VDD) U1.Y2(VDD) U1.Y4(VDD) U1.Y6(VDD) U1.Y8(VDD) U1.Y10(VDD) U1.Y12(VDD) U1.Y14(VDD) U1.Y16(VDD) U1.Y18(VDD) U1.Y20(VDD) U2.A3(VDD) U2.A5(VDD) U2.A7(VDD) U2.A9(VDD) U2.A11(VDD) U2.A13(VDD) U2.A15(VDD) U2.A17(VDD) U2.A19(VDD) U2.AA1(VDD) U2.AA3(VDD) U2.AA5(VDD) U2.AA7(VDD) U2.AA9(VDD) U2.AA11(VDD) U2.AA13(VDD) U2.AA15(VDD) U2.AA17(VDD) U2.AB2(VDD) U2.AB4(VDD) U2.AB6(VDD) U2.AB8(VDD) U2.AB10(VDD) U2.AB12(VDD) U2.AB14(VDD) U2.AB16(VDD) U2.AB18(VDD) U2.B2(VDD) U2.B4(VDD) U2.B6(VDD) U2.B8(VDD) U2.B10(VDD) U2.B12(VDD) U2.B14(VDD) U2.B16(VDD) U2.B18(VDD) U2.B20(VDD) U2.C1(VDD) U2.C3(VDD) U2.C5(VDD) U2.C7(VDD) U2.C9(VDD) U2.C11(VDD) U2.C13(VDD) U2.C15(VDD) U2.C17(VDD) U2.C19(VDD) U2.D2(VDD) U2.D4(VDD) U2.D6(VDD) U2.D8(VDD) U2.D10(VDD) U2.D12(VDD) U2.D14(VDD) U2.D16(VDD) U2.D18(VDD) U2.D20(VDD) U2.E1(VDD) U2.E3(VDD) U2.E5(VDD) U2.E7(VDD) U2.E9(VDD) U2.E11(VDD) U2.E13(VDD) U2.E15(VDD) U2.E17(VDD) U2.E19(VDD) U2.E21(VDD) U2.F2(VDD) U2.F4(VDD) U2.F6(VDD) U2.F8(VDD) U2.F10(VDD) U2.F12(VDD) U2.F14(VDD) U2.F16(VDD) U2.F18(VDD) U2.F20(VDD) U2.G1(VDD) U2.G3(VDD) U2.G5(VDD) U2.G7(VDD) U2.G9(VDD) U2.G11(VDD) U2.G13(VDD) U2.G15(VDD) U2.G17(VDD) U2.G19(VDD) U2.G21(VDD) U2.H2(VDD) U2.H4(VDD) U2.H6(VDD) U2.H8(VDD) U2.H10(VDD) U2.H12(VDD) U2.H14(VDD) U2.H16(VDD) U2.H18(VDD) U2.H20(VDD) U2.J1(VDD) U2.J3(VDD) U2.J5(VDD) U2.J7(VDD) U2.J9(VDD) U2.J11(VDD) U2.J13(VDD) U2.J15(VDD) U2.J17(VDD) U2.J19(VDD) U2.J21(VDD) U2.K2(VDD) U2.K4(VDD) U2.K6(VDD) U2.K8(VDD) U2.K10(VDD) U2.K12(VDD) U2.K14(VDD) U2.K16(VDD) U2.K18(VDD) U2.K20(VDD) U2.L1(VDD) U2.L3(VDD) U2.L5(VDD) U2.L7(VDD) U2.L9(VDD) U2.L11(VDD) U2.L13(VDD) U2.L15(VDD) U2.L17(VDD) U2.L19(VDD) U2.L21(VDD) U2.M2(VDD) U2.M4(VDD) U2.M6(VDD) U2.M8(VDD) U2.M10(VDD) U2.M12(VDD) U2.M14(VDD) U2.M16(VDD) U2.M18(VDD) U2.N1(VDD) U2.N3(VDD) U2.N5(VDD) U2.N7(VDD) U2.N9(VDD) U2.N11(VDD) U2.N13(VDD) U2.N15(VDD) U2.N17(VDD) U2.N19(VDD) U2.N21(VDD) U2.P2(VDD) U2.P4(VDD) U2.P6(VDD) U2.P8(VDD) U2.P10(VDD) U2.P12(VDD) U2.P14(VDD) U2.P16(VDD) U2.P18(VDD) U2.P20(VDD) U2.R1(VDD) U2.R3(VDD) U2.R5(VDD) U2.R7(VDD) U2.R9(VDD) U2.R11(VDD) U2.R13(VDD) U2.R15(VDD) U2.R17(VDD) U2.R19(VDD) U2.R21(VDD) U2.T2(VDD) U2.T4(VDD) U2.T6(VDD) U2.T8(VDD) U2.T10(VDD) U2.T12(VDD) U2.T14(VDD) U2.T16(VDD) U2.T18(VDD) U2.T20(VDD) U2.U1(VDD) U2.U3(VDD) U2.U5(VDD) U2.U7(VDD) U2.U9(VDD) U2.U11(VDD) U2.U13(VDD) U2.U15(VDD) U2.U17(VDD) U2.U19(VDD) U2.U21(VDD) U2.V2(VDD) U2.V4(VDD) U2.V6(VDD) U2.V8(VDD) U2.V10(VDD) U2.V12(VDD) U2.V14(VDD) U2.V16(VDD) U2.V18(VDD) U2.V20(VDD) U2.W1(VDD) U2.W3(VDD) U2.W5(VDD) U2.W7(VDD) U2.W9(VDD) U2.W11(VDD) U2.W13(VDD) U2.W15(VDD) U2.W17(VDD) U2.W19(VDD) U2.W21(VDD) U2.Y2(VDD) U2.Y4(VDD) U2.Y6(VDD) U2.Y8(VDD) U2.Y10(VDD) U2.Y12(VDD) U2.Y14(VDD) U2.Y16(VDD) U2.Y18(VDD) U2.Y20(VDD) U3.A3(VDD) U3.A5(VDD) U3.A7(VDD) U3.A9(VDD) U3.A11(VDD) U3.A13(VDD) U3.A15(VDD) U3.A17(VDD) U3.A19(VDD) U3.AA1(VDD) U3.AA3(VDD) U3.AA5(VDD) U3.AA7(VDD) U3.AA9(VDD) U3.AA11(VDD) U3.AA13(VDD) U3.AA15(VDD) U3.AA17(VDD) U3.AB2(VDD) U3.AB4(VDD) U3.AB6(VDD) U3.AB8(VDD) U3.AB10(VDD) U3.AB12(VDD) U3.AB14(VDD) U3.AB16(VDD) U3.AB18(VDD) U3.B2(VDD) U3.B4(VDD) U3.B6(VDD) U3.B8(VDD) U3.B10(VDD) U3.B12(VDD) U3.B14(VDD) U3.B16(VDD) U3.B18(VDD) U3.B20(VDD) U3.C1(VDD) U3.C3(VDD) U3.C5(VDD) U3.C7(VDD) U3.C9(VDD) U3.C11(VDD) U3.C13(VDD) U3.C15(VDD) U3.C17(VDD) U3.C19(VDD) U3.D2(VDD) U3.D4(VDD) U3.D6(VDD) U3.D8(VDD) U3.D10(VDD) U3.D12(VDD) U3.D14(VDD) U3.D16(VDD) U3.D18(VDD) U3.D20(VDD) U3.E1(VDD) U3.E3(VDD) U3.E5(VDD) U3.E7(VDD) U3.E9(VDD) U3.E11(VDD) U3.E13(VDD) U3.E15(VDD) U3.E17(VDD) U3.E19(VDD) U3.E21(VDD) U3.F2(VDD) U3.F4(VDD) U3.F6(VDD) U3.F8(VDD) U3.F10(VDD) U3.F12(VDD) U3.F14(VDD) U3.F16(VDD) U3.F18(VDD) U3.F20(VDD) U3.G1(VDD) U3.G3(VDD) U3.G5(VDD) U3.G7(VDD) U3.G9(VDD) U3.G11(VDD) U3.G13(VDD) U3.G15(VDD) U3.G17(VDD) U3.G19(VDD) U3.G21(VDD) U3.H2(VDD) U3.H4(VDD) U3.H6(VDD) U3.H8(VDD) U3.H10(VDD) U3.H12(VDD) U3.H14(VDD) U3.H16(VDD) U3.H18(VDD) U3.H20(VDD) U3.J1(VDD) U3.J3(VDD) U3.J5(VDD) U3.J7(VDD) U3.J9(VDD) U3.J11(VDD) U3.J13(VDD) U3.J15(VDD) U3.J17(VDD) U3.J19(VDD) U3.J21(VDD) U3.K2(VDD) U3.K4(VDD) U3.K6(VDD) U3.K8(VDD) U3.K10(VDD) U3.K12(VDD) U3.K14(VDD) U3.K16(VDD) U3.K18(VDD) U3.K20(VDD) U3.L1(VDD) U3.L3(VDD) U3.L5(VDD) U3.L7(VDD) U3.L9(VDD) U3.L11(VDD) U3.L13(VDD) U3.L15(VDD) U3.L17(VDD) U3.L19(VDD) U3.L21(VDD) U3.M2(VDD) U3.M4(VDD) U3.M6(VDD) U3.M8(VDD) U3.M10(VDD) U3.M12(VDD) U3.M14(VDD) U3.M16(VDD) U3.M18(VDD) U3.N1(VDD) U3.N3(VDD) U3.N5(VDD) U3.N7(VDD) U3.N9(VDD) U3.N11(VDD) U3.N13(VDD) U3.N15(VDD) U3.N17(VDD) U3.N19(VDD) U3.N21(VDD) U3.P2(VDD) U3.P4(VDD) U3.P6(VDD) U3.P8(VDD) U3.P10(VDD) U3.P12(VDD) U3.P14(VDD) U3.P16(VDD) U3.P18(VDD) U3.P20(VDD) U3.R1(VDD) U3.R3(VDD) U3.R5(VDD) U3.R7(VDD) U3.R9(VDD) U3.R11(VDD) U3.R13(VDD) U3.R15(VDD) U3.R17(VDD) U3.R19(VDD) U3.R21(VDD) U3.T2(VDD) U3.T4(VDD) U3.T6(VDD) U3.T8(VDD) U3.T10(VDD) U3.T12(VDD) U3.T14(VDD) U3.T16(VDD) U3.T18(VDD) U3.T20(VDD) U3.U1(VDD) U3.U3(VDD) U3.U5(VDD) U3.U7(VDD) U3.U9(VDD) U3.U11(VDD) U3.U13(VDD) U3.U15(VDD) U3.U17(VDD) U3.U19(VDD) U3.U21(VDD) U3.V2(VDD) U3.V4(VDD) U3.V6(VDD) U3.V8(VDD) U3.V10(VDD) U3.V12(VDD) U3.V14(VDD) U3.V16(VDD) U3.V18(VDD) U3.V20(VDD) U3.W1(VDD) U3.W3(VDD) U3.W5(VDD) U3.W7(VDD) U3.W9(VDD) U3.W11(VDD) U3.W13(VDD) U3.W15(VDD) U3.W17(VDD) U3.W19(VDD) U3.W21(VDD) U3.Y2(VDD) U3.Y4(VDD) U3.Y6(VDD) U3.Y8(VDD) U3.Y10(VDD) U3.Y12(VDD) U3.Y14(VDD) U3.Y16(VDD) U3.Y18(VDD) U3.Y20(VDD) U4.A3(VDD) U4.A5(VDD) U4.A7(VDD) U4.A9(VDD) U4.A11(VDD) U4.A13(VDD) U4.A15(VDD) U4.A17(VDD) U4.A19(VDD) U4.AA1(VDD) U4.AA3(VDD) U4.AA5(VDD) U4.AA7(VDD) U4.AA9(VDD) U4.AA11(VDD) U4.AA13(VDD) U4.AA15(VDD) U4.AA17(VDD) U4.AB2(VDD) U4.AB4(VDD) U4.AB6(VDD) U4.AB8(VDD) U4.AB10(VDD) U4.AB12(VDD) U4.AB14(VDD) U4.AB16(VDD) U4.AB18(VDD) U4.B2(VDD) U4.B4(VDD) U4.B6(VDD) U4.B8(VDD) U4.B10(VDD) U4.B12(VDD) U4.B14(VDD) U4.B16(VDD) U4.B18(VDD) U4.B20(VDD) U4.C1(VDD) U4.C3(VDD) U4.C5(VDD) U4.C7(VDD) U4.C9(VDD) U4.C11(VDD) U4.C13(VDD) U4.C15(VDD) U4.C17(VDD) U4.C19(VDD) U4.D2(VDD) U4.D4(VDD) U4.D6(VDD) U4.D8(VDD) U4.D10(VDD) U4.D12(VDD) U4.D14(VDD) U4.D16(VDD) U4.D18(VDD) U4.D20(VDD) U4.E1(VDD) U4.E3(VDD) U4.E5(VDD) U4.E7(VDD) U4.E9(VDD) U4.E11(VDD) U4.E13(VDD) U4.E15(VDD) U4.E17(VDD) U4.E19(VDD) U4.E21(VDD) U4.F2(VDD) U4.F4(VDD) U4.F6(VDD) U4.F8(VDD) U4.F10(VDD) U4.F12(VDD) U4.F14(VDD) U4.F16(VDD) U4.F18(VDD) U4.F20(VDD) U4.G1(VDD) U4.G3(VDD) U4.G5(VDD) U4.G7(VDD) U4.G9(VDD) U4.G11(VDD) U4.G13(VDD) U4.G15(VDD) U4.G17(VDD) U4.G19(VDD) U4.G21(VDD) U4.H2(VDD) U4.H4(VDD) U4.H6(VDD) U4.H8(VDD) U4.H10(VDD) U4.H12(VDD) U4.H14(VDD) U4.H16(VDD) U4.H18(VDD) U4.H20(VDD) U4.J1(VDD) U4.J3(VDD) U4.J5(VDD) U4.J7(VDD) U4.J9(VDD) U4.J11(VDD) U4.J13(VDD) U4.J15(VDD) U4.J17(VDD) U4.J19(VDD) U4.J21(VDD) U4.K2(VDD) U4.K4(VDD) U4.K6(VDD) U4.K8(VDD) U4.K10(VDD) U4.K12(VDD) U4.K14(VDD) U4.K16(VDD) U4.K18(VDD) U4.K20(VDD) U4.L1(VDD) U4.L3(VDD) U4.L5(VDD) U4.L7(VDD) U4.L9(VDD) U4.L11(VDD) U4.L13(VDD) U4.L15(VDD) U4.L17(VDD) U4.L19(VDD) U4.L21(VDD) U4.M2(VDD) U4.M4(VDD) U4.M6(VDD) U4.M8(VDD) U4.M10(VDD) U4.M12(VDD) U4.M14(VDD) U4.M16(VDD) U4.M18(VDD) U4.N1(VDD) U4.N3(VDD) U4.N5(VDD) U4.N7(VDD) U4.N9(VDD) U4.N11(VDD) U4.N13(VDD) U4.N15(VDD) U4.N17(VDD) U4.N19(VDD) U4.N21(VDD) U4.P2(VDD) U4.P4(VDD) U4.P6(VDD) U4.P8(VDD) U4.P10(VDD) U4.P12(VDD) U4.P14(VDD) U4.P16(VDD) U4.P18(VDD) U4.P20(VDD) U4.R1(VDD) U4.R3(VDD) U4.R5(VDD) U4.R7(VDD) U4.R9(VDD) U4.R11(VDD) U4.R13(VDD) U4.R15(VDD) U4.R17(VDD) U4.R19(VDD) U4.R21(VDD) U4.T2(VDD) U4.T4(VDD) U4.T6(VDD) U4.T8(VDD) U4.T10(VDD) U4.T12(VDD) U4.T14(VDD) U4.T16(VDD) U4.T18(VDD) U4.T20(VDD) U4.U1(VDD) U4.U3(VDD) U4.U5(VDD) U4.U7(VDD) U4.U9(VDD) U4.U11(VDD) U4.U13(VDD) U4.U15(VDD) U4.U17(VDD) U4.U19(VDD) U4.U21(VDD) U4.V2(VDD) U4.V4(VDD) U4.V6(VDD) U4.V8(VDD) U4.V10(VDD) U4.V12(VDD) U4.V14(VDD) U4.V16(VDD) U4.V18(VDD) U4.V20(VDD) U4.W1(VDD) U4.W3(VDD) U4.W5(VDD) U4.W7(VDD) U4.W9(VDD) U4.W11(VDD) U4.W13(VDD) U4.W15(VDD) U4.W17(VDD) U4.W19(VDD) U4.W21(VDD) U4.Y2(VDD) U4.Y4(VDD) U4.Y6(VDD) U4.Y8(VDD) U4.Y10(VDD) U4.Y12(VDD) U4.Y14(VDD) U4.Y16(VDD) U4.Y18(VDD) U4.Y20(VDD) ; port 1V

## Notes on the sheet
- Block Name
- Document Type: Schematic
- Size
- File Name
- Variant
- Rev.
- Project Name
- Sheet
- /

## Library data of the parts
C19 C36 C148-C155 C166 C167 C169-C196 = CAP000028169: DB_PART_TYPE: Ceramic_SMD\Standard_X7R; DB_MANUFACTURER_PART: KEMET    C0603C474J4RAC; NOTE: <NOTE>; DB_T_RANGE: -55 to 125; DB_PACKAGE: 0603; DB_DESCRIPTION: C X7R 470nF 5% 16V 0603; DB_STATUS: NEW; DB_PART_NUMBER: CAP000028169; DB_VALUE: 470nF; DB_PCB_DEVICE: SMD_0603_CAPC1608X95N; DB_APPROVED_ON: 09.10.2010; DB_DATASHEET: http://john.epiqdesign.com/projects/CIS_Datasheets/F3102_CE_Kemet.pdf?rev=92&sc=0
C156-C165 C197-C226 = CAP000047355: DB_PART_TYPE: Ceramic_SMD\Standard_X5R; DB_MANUFACTURER_PART: SAMSUNG    CL32A227MQVNNNE; NOTE: <NOTE>; DB_T_RANGE: -55 to 85; DB_PACKAGE: 1210; DB_DESCRIPTION: C X5R 220uF 20% 6.3V 1210; DB_APPROVED_BY: VSN; DB_STATUS: NEW; DB_PART_NUMBER: CAP000047355; DB_VALUE: 220uF; DB_PCB_DEVICE: SMD_1210_CAPC3225X279N; DB_APPROVED_ON: 07.05.2014 11:28:08; DB_DATASHEET: http://john.epiqdesign.com/projects/CIS_Datasheets/CAP_CL32A227MQVNNNE.pdf?rev=1401&sc=0
U1-U4 = IC_RockerBox: DB_PCB_DEVICE: SMD_BGA480C80P22X22